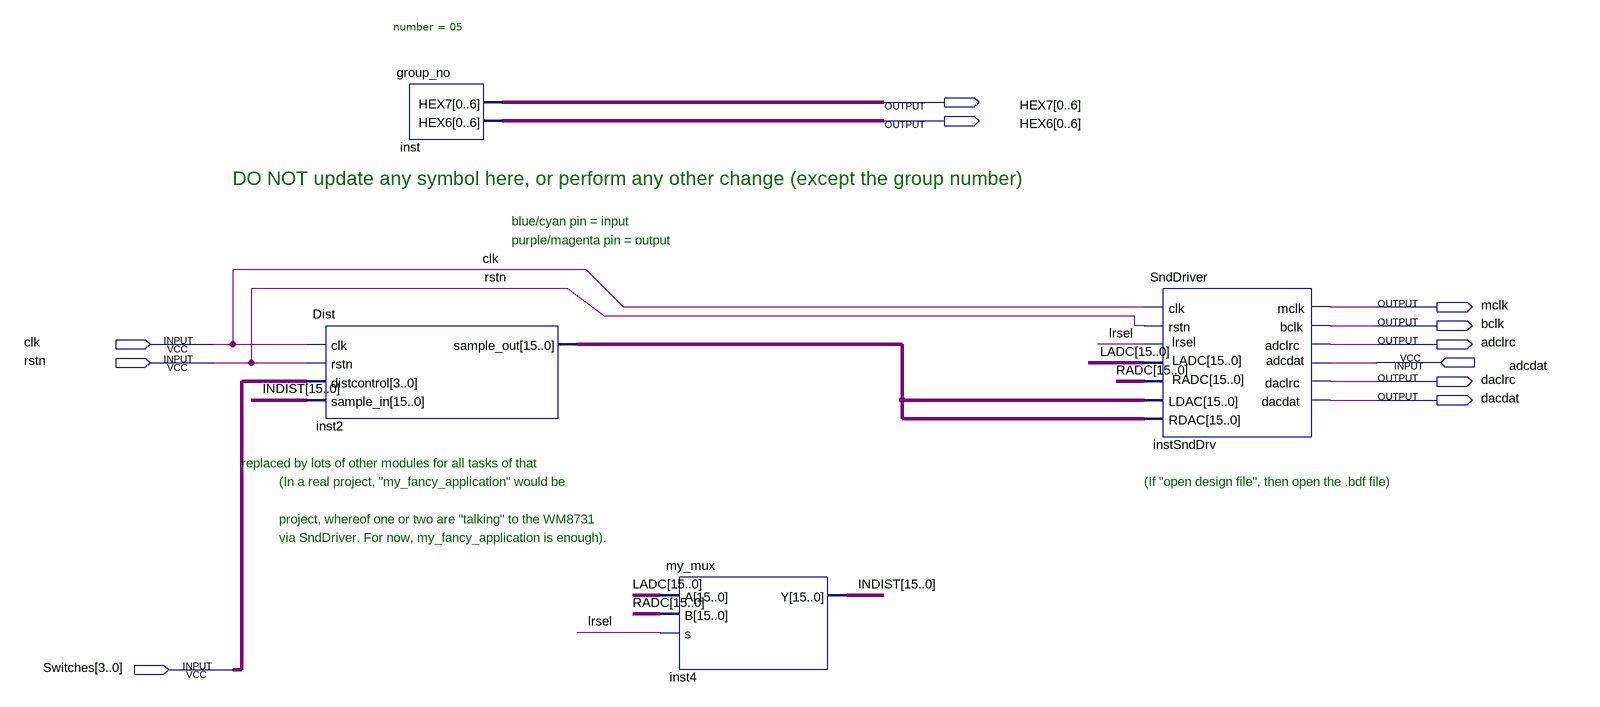
[diagram p0: schematic sheet]
// Quartus schematic Sound.bdf as structural Verilog: 4 symbols, 11 pins
module Sound (
  input  clk,
  input  rstn,
  input  adcdat,
  input  [3:0] Switches,
  output [0:6] HEX7,
  output [0:6] HEX6,
  output mclk,
  output bclk,
  output adclrc,
  output daclrc,
  output dacdat
);

  wire lrsel;
  wire [15:0] INDIST, inst2_sample_out, LADC, RADC;

  Dist inst2 (.clk(clk), .rstn(rstn), .distcontrol(Switches), .sample_in(INDIST), .sample_out(inst2_sample_out));
  group_no #(.number(05)) inst (.HEX7(HEX7), .HEX6(HEX6));
  my_mux inst4 (.A(LADC), .B(RADC), .s(lrsel), .Y(INDIST));
  SndDriver instSndDrv (
    .clk(clk), .rstn(rstn), .LDAC(inst2_sample_out), .adcdat(adcdat), .RDAC(inst2_sample_out), .mclk(mclk),
    .bclk(bclk), .adclrc(adclrc), .daclrc(daclrc), .lrsel(lrsel), .LADC(LADC), .dacdat(dacdat), .RADC(RADC));

  // Notes on the sheet:
  //   DO NOT update any symbol here, or perform any other change (except the group number)
  //   blue/cyan pin = input
  //   purple/magenta pin = output
  //   replaced by lots of other modules for all tasks of that
  //   (In a real project, "my_fancy_application" would be
  //   (If "open design file", then open the .bdf file)
  //   project, whereof one or two are "talking" to the WM8731
  //   via SndDriver. For now, my_fancy_application is enough).
endmodule
